# Altium schematic sheet LIA.SchDoc
size A4
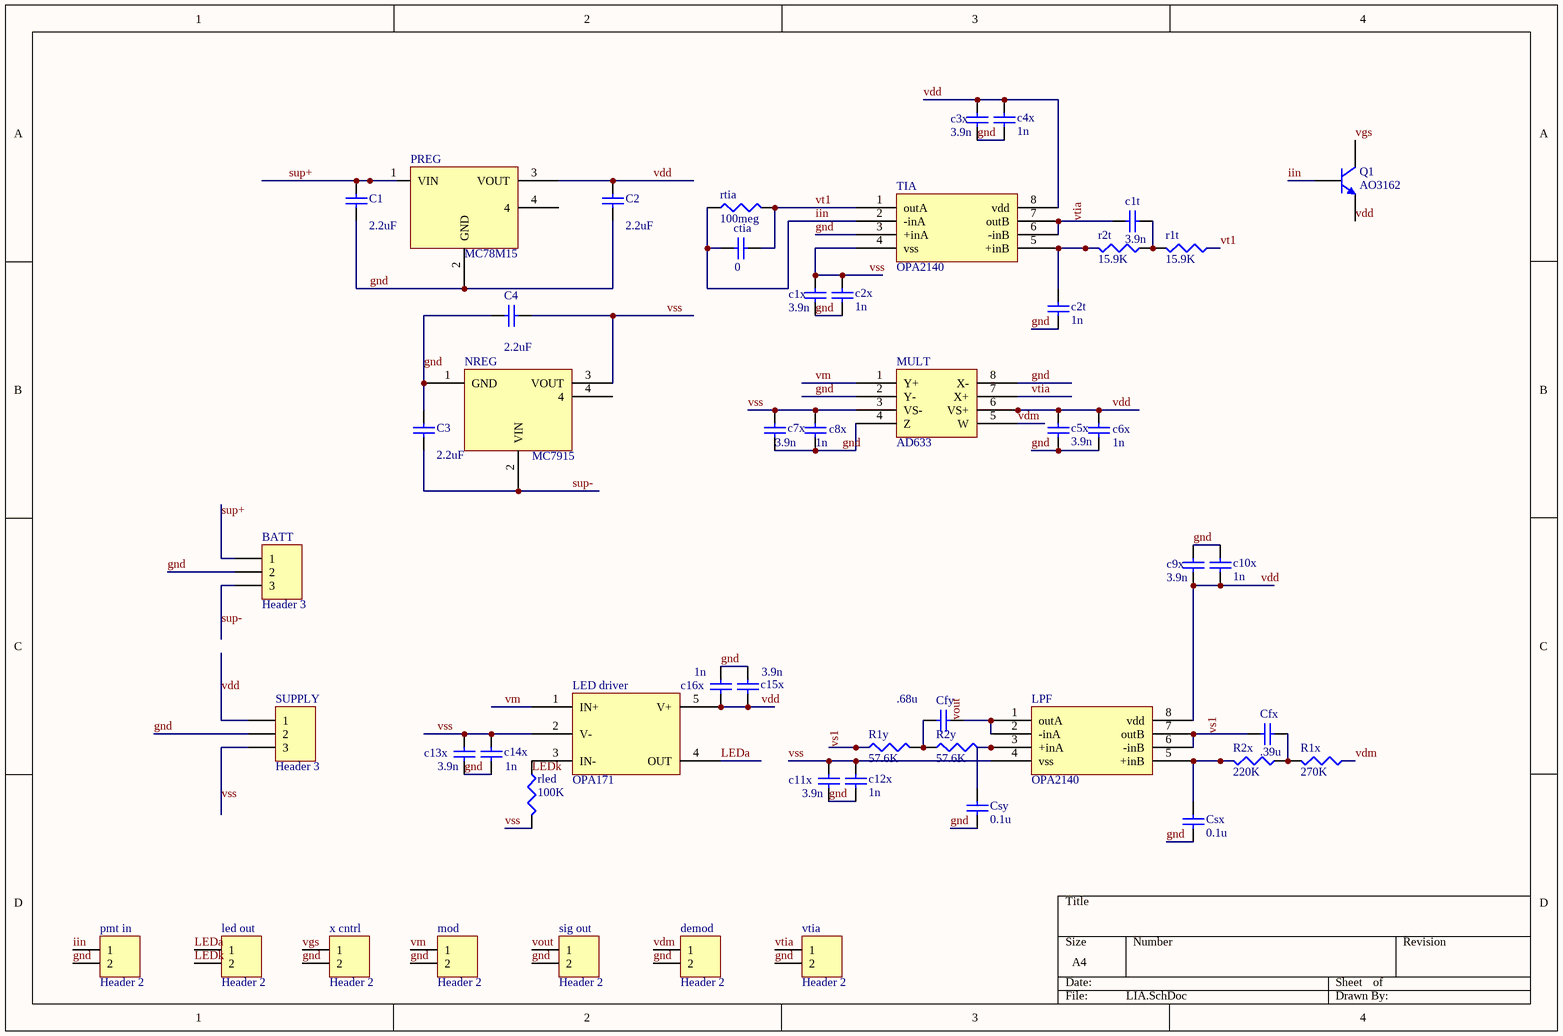
[diagram p0: LIA.SchDoc]

## Parts
BATT  Header 3  [HDR1X3]
C1  value 2.2uF  [0402]  (hidden comment: GRM155R61C225KE11D)
c1t  value 3.9n  [0402]  (hidden comment: GRM155R71H392KA01D)
c1x  value 3.9n  [0402]  (hidden comment: GRM155R71H392KA01D)
C2  value 2.2uF  [0402]  (hidden comment: GRM155R61C225KE11D)
c2t  value 1n  [0402]  (hidden comment: GRM155R71H102KA01D)
c2x  value 1n  [0402]  (hidden comment: GRM155R71H102KA01D)
C3  value 2.2uF  [0402]  (hidden comment: GRM155R61C225KE11D)
c3x  value 3.9n  [0402]  (hidden comment: GRM155R71H392KA01D)
C4  value 2.2uF  [0402]  (hidden comment: GRM155R61C225KE11D)
c4x  value 1n  [0402]  (hidden comment: GRM155R71H102KA01D)
c5x  value 3.9n  [0402]  (hidden comment: GRM155R71H392KA01D)
c6x  value 1n  [0402]  (hidden comment: GRM155R71H102KA01D)
c7x  value 3.9n  [0402]  (hidden comment: GRM155R71H392KA01D)
c8x  value 1n  [0402]  (hidden comment: GRM155R71H102KA01D)
c9x  value 3.9n  [0402]  (hidden comment: GRM155R71H392KA01D)
c10x  value 1n  [0402]  (hidden comment: GRM155R71H102KA01D)
c11x  value 3.9n  [0402]  (hidden comment: GRM155R71H392KA01D)
c12x  value 1n  [0402]  (hidden comment: GRM155R71H102KA01D)
c13x  value 3.9n  [0402]  (hidden comment: GRM155R71H392KA01D)
c14x  value 1n  [0402]  (hidden comment: GRM155R71H102KA01D)
c15x  value 3.9n  [0402]  (hidden comment: GRM155R71H392KA01D)
c16x  value 1n  [0402]  (hidden comment: GRM155R71H102KA01D)
Cfx  value .39u  [0402]  (hidden comment: GRM155R61A394KE15D)
Cfy  value .68u  [0402]  (hidden comment: C1005X5R1C684K050BC)
Csx  value 0.1u  [0402]  (hidden comment: GRM155R61C104KA88J)
Csy  value 0.1u  [0402]  (hidden comment: GRM155R61C104KA88J)
ctia  value 0  [1206]  (hidden comment: N/A)
demod  Header 2  [HDR1X2]
LED_driver  OPA171  [S5]
led_out  Header 2  [HDR1X2]
LPF  OPA2140  [D008_L]
mod  Header 2  [HDR1X2]
MULT  AD633  [D008_L]
NREG  MC7915  [D2PAK_L]
pmt_in  Header 2  [HDR1X2]
PREG  MC78M15  [D2PAK_L]
Q1  AO3162  [SOT-23B_N]
r1t  value 15.9K  [J1-0603]  (hidden comment: RC0603JR-0716KL)
R1x  value 270K  [J1-0603]  (hidden comment: RC0603FR-07270KL)
R1y  value 57.6K  [J1-0603]  (hidden comment: RC0603FR-0757K6L)
r2t  value 15.9K  [J1-0603]  (hidden comment: RC0603JR-0716KL)
R2x  value 220K  [J1-0603]  (hidden comment: RC0603FR-07220KL)
R2y  value 57.6K  [J1-0603]  (hidden comment: RC0603FR-0757K6L)
rled  value 100K  [J1-0603]  (hidden comment: RC0603FR-07100KL)
rtia  value 100meg  [1206]  (hidden comment: HMC1206JT100M)
sig_out  Header 2  [HDR1X2]
SUPPLY  Header 3  [HDR1X3]
TIA  OPA2140  [D008_L]
vtia  Header 2  [HDR1X2]
x_cntrl  Header 2  [HDR1X2]

## Nets
gnd: BATT.2 C1.1 c1x.2 C2.1 c2t.1 c2x.2 C3.1 c3x.2 C4.1 c4x.2 c5x.1 c6x.1 c7x.1 c8x.1 c9x.2 c10x.2 c11x.2 c12x.2 c13x.2 c14x.2 c15x.2 c16x.2 Csx.1 Csy.1 demod.2 mod.2 MULT.2(Y-) MULT.4(Z) MULT.8(X-) NREG.1(GND) pmt_in.2 PREG.2(GND) sig_out.2 SUPPLY.2 TIA.3(+inA) vtia.2 x_cntrl.2
iin: ctia.1 pmt_in.1 Q1.2(B) rtia.1 TIA.2(-inA)
LEDa: LED_driver.4(OUT) led_out.1
LEDk: led_out.2
sup+: BATT.1 C1.2 PREG.1(VIN)
sup-: BATT.3 C3.2 NREG.2(VIN)
vdd: C2.2 c3x.1 c4x.1 c5x.2 c6x.2 c9x.1 c10x.1 c15x.1 c16x.1 LED_driver.5(V+) LPF.8(vdd) MULT.6(VS+) PREG.3(VOUT) Q1.3(E) SUPPLY.1 TIA.8(vdd)
vdm: demod.1 MULT.5(W) R1x.1
vgs: Q1.1(C) x_cntrl.1
vm: LED_driver.1(IN+) mod.1 MULT.1(Y+)
vout: Cfy.1 LPF.1(outA) LPF.2(-inA) sig_out.1
vs1: Cfx.2 LPF.6(-inB) LPF.7(outB) R1y.1
vss: c1x.1 c2x.1 C4.2 c7x.2 c8x.2 c11x.1 c12x.1 c13x.1 c14x.1 LED_driver.2(V-) LPF.4(vss) MULT.3(VS-) NREG.3(VOUT) rled.2 SUPPLY.3 TIA.4(vss)
vt1: ctia.2 r1t.1 rtia.2 TIA.1(outA)
vtia: c1t.2 MULT.7(X+) TIA.6(-inB) TIA.7(outB) vtia.1
Netc1t_1: c1t.1 r1t.2 r2t.1
Netc2t_2: c2t.2 r2t.2 TIA.5(+inB)
NetCfx_1: Cfx.1 R1x.2 R2x.1
NetCfy_2: Cfy.2 R1y.2 R2y.1
NetCsx_2: Csx.2 LPF.5(+inB) R2x.2
NetCsy_2: Csy.2 LPF.3(+inA) R2y.2
NetLED_driver_3: LED_driver.3(IN-) rled.1

Not connected (* = marked no-connect by the designer): NREG 4; PREG 4

## Notes on the sheet
- Labels drawn without touching a wire or pin: LEDk

## Library data of the parts
BATT SUPPLY = Header 3: Header, 3-Pin; LatestRevisionDate: 17-Jul-2002; LatestRevisionNote: Re-released for DXP Platform.; Publisher: Altium Limited
C1 c1t c1x C2 c2t c2x C3 c3x C4 c4x c5x c6x c7x c8x c9x c10x c11x c12x c13x c14x c15x c16x Cfx Cfy Csx Csy = C0402: Ceramic Chip Capacitor - Standard; Note: Footprint corresponds to dimensions for bulk cassette packaging. This case size has tightened tolerances.; Published: 17-Jul-2002; LatestRevisionDate: 19-Mar-2004; LatestRevisionNote: Silkscreen size reduced.; DatasheetDocument: Mar-2001; PackageDocument: Mar-2001; PackageReference: 0402; Publisher: Altium Limited; Code_JEITA: 0402; Code_IPC: 1005 [0402]; ComponentLink1Description: Manufacturer Link; ComponentLink1URL: http://www.kemet.com/; ComponentLink2Description: Datasheet; ComponentLink2URL: http://www.kemet.com/kemet/web/homepage/kechome.nsf/vapubfilesname/F3102TA.pdf/$file/F3102TA.pdf
ctia = C1210: Ceramic Chip Capacitor - Standard; Published: 17-Jul-2002; Publisher: Altium Limited; LatestRevisionDate: 19-Mar-2004; LatestRevisionNote: Silkscreen size reduced.; DatasheetDocument: Mar-2001; PackageDocument: Mar-2001; PackageReference: 1210; Code_JEITA: 1210; Code_IPC: 3225 [1210]; ComponentLink1Description: Manufacturer Link; ComponentLink1URL: http://www.kemet.com/; ComponentLink2Description: Datasheet; ComponentLink2URL: http://www.kemet.com/kemet/web/homepage/kechome.nsf/vapubfilesname/F3102TA.pdf/$file/F3102TA.pdf
demod led_out mod pmt_in sig_out vtia x_cntrl = Header 2: Header, 2-Pin; LatestRevisionDate: 17-Jul-2002; LatestRevisionNote: Re-released for DXP Platform.; Publisher: Altium Limited
LED_driver = OPA171: Single supply opamp SOT 553
LPF TIA = OPA2211: dual channel JFET op amp
MULT = AD633: Analog multiplier
NREG = MC7915: -15 V LDO regulator
PREG = MC78M15: +15 V LDO regulator
Q1 = QNPN: NPN Bipolar Transistor; Published: 8-Jun-2000; LatestRevisionDate: 29-May-2009; LatestRevisionNote: IPC-7351 Footprint Added.; PackageVersion: Aug-1999; PackageReference: SOT-23B; Publisher: Altium Limited; PackageDescription: 3-Pin SOT-23 Package 0.95 mm Pitch, 2.4 mm Lead Span
r1t R1x R1y r2t R2x R2y rled rtia = Res3: Resistor; Published: 8-Jun-2000; Publisher: Altium Limited; LatestRevisionDate: 29-May-2009; LatestRevisionNote: IPC-7351 Footprint Added.; PackageReference: J1-0603; PackageDescription: Chip Resistor